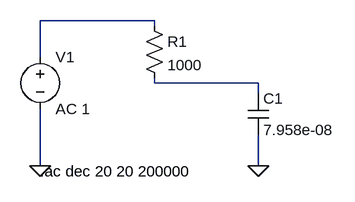
[diagram p0: schematic circuit.asc]
circuit.asc, the LTspice schematic file:
Version 4
SHEET 1 1760 880
SYMBOL voltage 128 136 R0
SYMATTR InstName V1
SYMATTR Value AC 1
SYMBOL res 288 88 R0
SYMATTR InstName R1
SYMATTR Value 1000
SYMBOL cap 448 208 R0
SYMATTR InstName C1
SYMATTR Value 7.958e-08
WIRE 128 96 304 96
WIRE 128 152 128 96
WIRE 128 232 128 320
WIRE 304 104 304 96
WIRE 304 184 304 192
WIRE 304 192 464 192
WIRE 464 208 464 192
WIRE 464 272 464 320
FLAG 128 320 0
FLAG 464 320 0
TEXT 128 328 Left 2 !.ac dec 20 20 200000

The netlist it stands for:
* circuit.asc
V1 N001 0 AC 1
R1 N001 N002 1000
C1 N002 0 7.958e-08
.ac dec 20 20 200000
.backanno
.end